# Altium schematic sheet CAN_5V.SchDoc
size A; DocumentNumber: 5; SheetNumber: 5; SheetTotal: 12
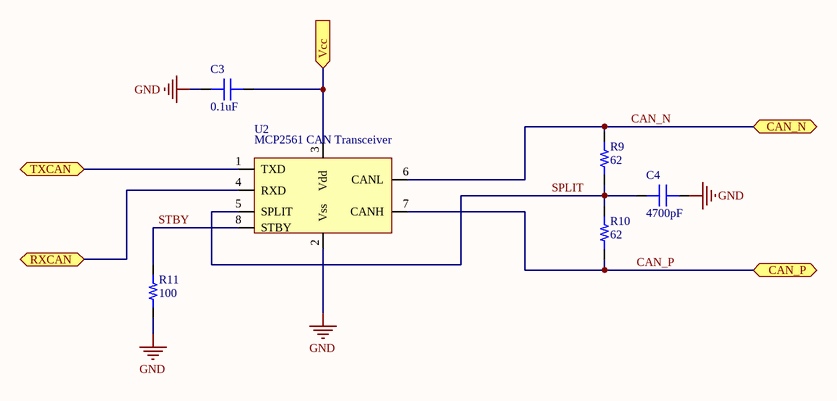
[diagram p0: CAN_5V.SchDoc]

## Parts
C3  capacitance: 0.1uF  [0603]  (hidden comment: capacitor)
C4  capacitance: 4700pF  [0603]  (hidden comment: capacitor)
R9  62  [RES 0603/1608]
R10  62  [RES 0603/1608]
R11  100  [RES 0603/1608]
U2  MCP2561 CAN Transceiver  [SOIC-8]

## Ports
CAN_N (bidir), CAN_P (bidir), RXCAN (bidir), TXCAN (bidir), Vcc (in)

## Nets
GND: C3.1 C4.2 R11.1 U2.2(Vss)
CAN_N: R9.2 U2.6(CANL) ; port CAN_N
CAN_P: R10.1 U2.7(CANH) ; port CAN_P
RXCAN: U2.4(RXD) ; port RXCAN
SPLIT: C4.1 R9.1 R10.2 U2.5(SPLIT)
STBY: R11.2 U2.8(STBY)
TXCAN: U2.1(TXD) ; port TXCAN
Vcc: C3.2 U2.3(Vdd) ; port Vcc

## Library data of the parts
C3 C4 = 1: Generic 0603 capacitor; id: 1; voltage: 50; dielectric: Ceramic; percent tolerance: 10; name: 0603 Capacitor; ESR: 1; package: 0603; quantity: 0
R9-R11 = 1: id: 1; name: 0603 Resistor; percent tolerance: 5; package: 0603; quantity: 0
  R9 R10: resistance: 62
  R11: resistance: 100
U2 = 5: id: 5; name: null; vcc: 0; type: CAN; package: SOIC-8; quantity: 0; link: https://www.digikey.com/product-detail/en/microchip-technology/MCP2561T-E-SN/MCP2561T-E-SNCT-ND/5148846